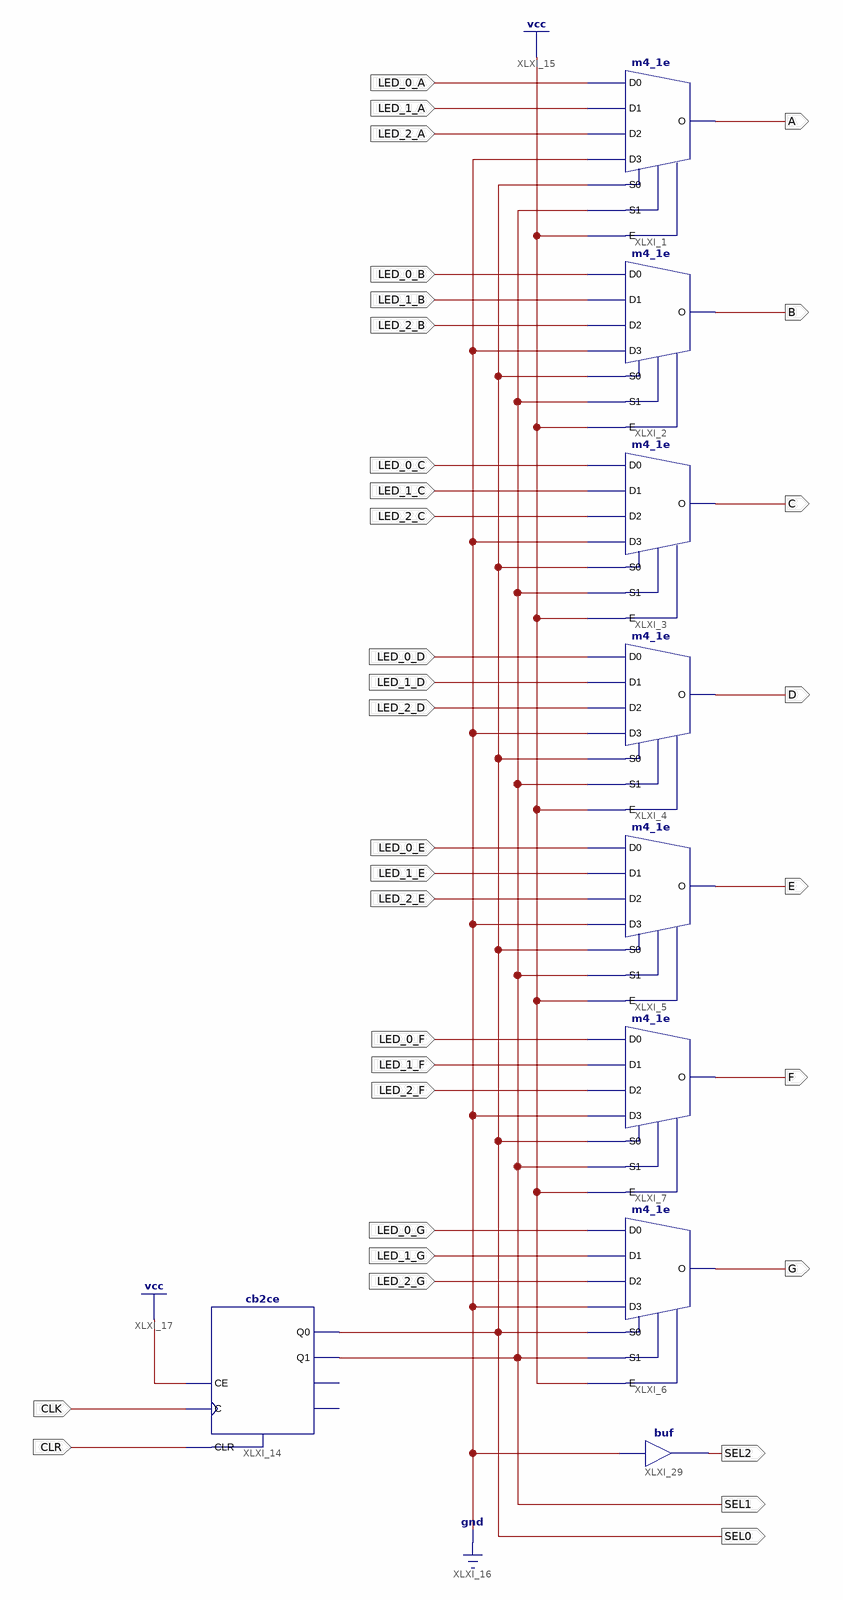
[diagram p0: schematic sheet 1]
// Xilinx ISE schematic seven_segment_select.sch (zynq) as structural Verilog: 9 symbols, 33 ports
module seven_segment_select (
  input  LED_0_A,
  input  LED_1_A,
  input  LED_2_A,
  input  LED_0_B,
  input  LED_1_B,
  input  LED_2_B,
  input  LED_0_C,
  input  LED_1_C,
  input  LED_2_C,
  input  LED_0_D,
  input  LED_1_D,
  input  LED_2_D,
  input  LED_0_E,
  input  LED_1_E,
  input  LED_2_E,
  input  LED_0_F,
  input  LED_1_F,
  input  LED_2_F,
  input  LED_0_G,
  input  LED_1_G,
  input  LED_2_G,
  input  CLK,
  input  CLR,
  output SEL1,
  output A,
  output B,
  output C,
  output D,
  output E,
  output F,
  output G,
  output SEL0,
  output SEL2
);

  m4_1e XLXI_3 (.D0(LED_0_C), .D1(LED_1_C), .D2(LED_2_C), .D3(1'b0), .E(1'b1), .S0(SEL0), .S1(SEL1), .O(C));
  m4_1e XLXI_1 (.D0(LED_0_A), .D1(LED_1_A), .D2(LED_2_A), .D3(1'b0), .E(1'b1), .S0(SEL0), .S1(SEL1), .O(A));
  m4_1e XLXI_2 (.D0(LED_0_B), .D1(LED_1_B), .D2(LED_2_B), .D3(1'b0), .E(1'b1), .S0(SEL0), .S1(SEL1), .O(B));
  m4_1e XLXI_4 (.D0(LED_0_D), .D1(LED_1_D), .D2(LED_2_D), .D3(1'b0), .E(1'b1), .S0(SEL0), .S1(SEL1), .O(D));
  m4_1e XLXI_5 (.D0(LED_0_E), .D1(LED_1_E), .D2(LED_2_E), .D3(1'b0), .E(1'b1), .S0(SEL0), .S1(SEL1), .O(E));
  m4_1e XLXI_7 (.D0(LED_0_F), .D1(LED_1_F), .D2(LED_2_F), .D3(1'b0), .E(1'b1), .S0(SEL0), .S1(SEL1), .O(F));
  m4_1e XLXI_6 (.D0(LED_0_G), .D1(LED_1_G), .D2(LED_2_G), .D3(1'b0), .E(1'b1), .S0(SEL0), .S1(SEL1), .O(G));
  cb2ce XLXI_14 (.C(CLK), .CE(1'b1), .CLR(CLR), .Q0(SEL0), .Q1(SEL1));  // open: CEO, TC
  buf XLXI_29 (SEL2, 1'b0);
endmodule
